# EAGLE design APDS-9801 (EAGLE 6.4)
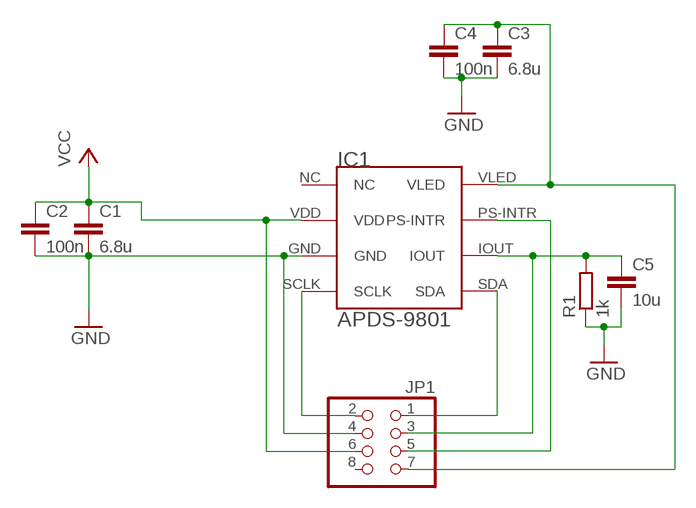
[diagram p0: schematic, sheet 1]

## Parts
C1  6.8u  C-EUC0805  [C0805]
C2  100n  C-EUC0805  [C0805]
C3  6.8u  C-EUC0805  [C0805]
C4  100n  C-EUC0805  [C0805]
C5  10u  C-EUC0805  [C0805]
IC1  APDS-9801  [APDS-9801]
JP1  PINHD-2X4  [2X04]
R1  1k  R-EU_M0805  [M0805]

## Nets
GND: C1.2 C2.2 C3.2 C4.2 C5.2 IC1.GND JP1.4 R1.1
N$1: IC1.PS-INTR JP1.5
N$3: C5.1 IC1.IOUT JP1.3 R1.2
N$5: C3.1 C4.1 IC1.VLED JP1.7
N$7: IC1.SCLK JP1.2
N$9: IC1.SDA JP1.1
VCC: C1.1 C2.1 IC1.VDD JP1.6
Unconnected: IC1.NC JP1.8

## Library data of the parts
C1-C5 = rcl:C-EU: CAPACITOR, European symbol
IC1 = BEEP:APDS-9801
JP1 = pinhead:PINHD-2X4: PIN HEADER
R1 = rcl:R-EU_: RESISTOR, European symbol

## Board
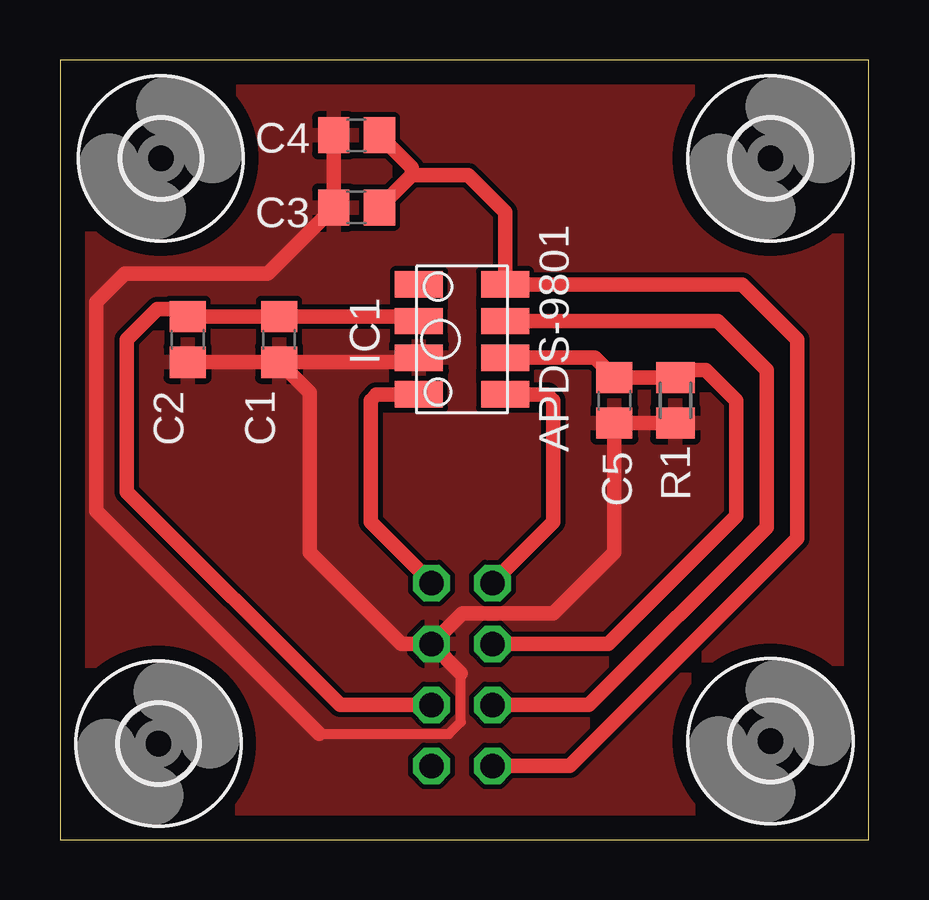
[diagram p1: board, top side]
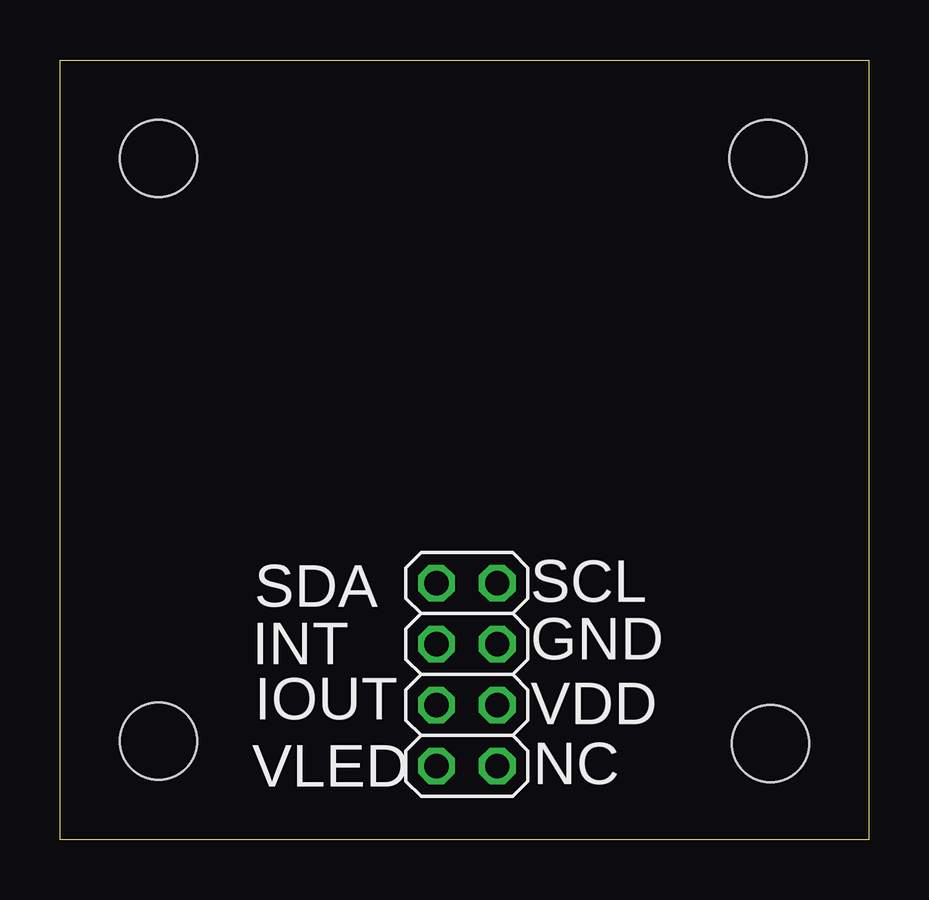
[diagram p2: board, bottom side, seen from below]

Size 33.7 x 32.5 mm. Coordinates in mm from the lower left corner, seen from the top.
Outline: 0,0 33.7,0 33.7,32.5 0,32.5 0,0
Copper layers (1*16): Top 0.035mm / dielectric 1.5mm / Bottom 0.035mm
Design rules "default": minimum track width 10mil, minimum drill 24mil, track to track 8mil, track to pad 8mil, pad to pad 8mil, via to via 8mil, smd to smd 8mil, copper to edge 40mil, drill to drill 8mil, minimum pad ring 10mil, minimum via ring 8mil, stop-mask expansion 4mil, vias tented up to drill 0mil, thermal gap 10mil

### Footprints (pad centres in the part's own frame; a part is rotated, then mirrored left to right if it is on the bottom)
C0805 = smd 1.3 x 1.5: 1 -0.95,0; 2 0.95,0
APDS-9801 = smd 1.1 x 2: GND 0.765,-1.8; IOUT 0.765,1.8; NC -2.295,-1.8; PS-INTR -0.765,1.8; SCLK 2.295,-1.8; SDA 2.295,1.8; VDD -0.765,-1.8; VLED -2.295,1.8
2X04 = drill 1.016 octagon: 1 -3.81,-1.27; 2 -3.81,1.27; 3 -1.27,-1.27; 4 -1.27,1.27; 5 1.27,-1.27; 6 1.27,1.27; 7 3.81,-1.27; 8 3.81,1.27
M0805 = smd 1.3 x 1.6: 1 -0.95,0; 2 0.95,0
3,2 = hole 3.2: 0,0

### Placement (x,y rotation side)
C1  9.13,20.85 270 top
C2  5.32,20.85 270 top
C3  12.36,26.35 180 top
C4  12.36,29.36 180 top
C5  23.1,18.31 270 top
IC1  16.75,20.85 270 top
JP1  16.75,6.88 270 bottom
R1  25.64,18.31 90 top
U$2  [3,2]  4.1,4 0 top
U$3  [3,2]  29.6,28.4 0 top
U$4  [3,2]  4.2,28.4 0 top
U$5  [3,2]  29.6,4.1 0 top

### Tracks (layer width: path | path; a pad name or v marks a point on that pad's centre or on a via)
GND
  Top 0.406: 10.8,4.4 16.2,4.4 16.7,4.9 16.7,6.93
  Top 0.61: C2.2 C1.2 | C1.2 14.77,19.9 IC1.GND | C1.2 10.4,18.63 10.4,11.96 14.21,8.15 JP1.4 | R1.1 C5.2 23.1,11.96 20.56,9.42 16.75,9.42 JP1.4 | C4.2 C3.2 8.66,23.6 2.7,23.6 1.5,22.4 1.5,13.7 10.8,4.4 | JP1.4 16.7,6.93
  pour Top: 0,32.5 33.7,32.5 33.7,0 0,0
N$1
  Top 0.61: IC1.PS-INTR 27.41,21.61 29.45,19.58 29.45,13.02 22.04,5.61 JP1.5
N$3
  Top 0.61: IC1.IOUT 22.27,20.09 C5.1 R1.2 25.96,19.58 26.91,19.58 28.18,18.31 28.18,13.49 22.84,8.15 JP1.3
N$5
  Top 0.61: 14.66,27.7 17,27.7 18.55,26.15 IC1.VLED 28.43,23.14 30.72,20.85 30.72,12.55 21.24,3.07 JP1.7 | 14.66,27.7 C3.1 | 14.66,27.7 14.66,28.01 C4.1
N$7
  Top 0.61: IC1.SCLK 13.19,18.55 12.94,18.31 12.94,13.23 JP1.2
N$9
  Top 0.61: IC1.SDA 20.32,18.55 20.56,18.31 20.56,13.23 JP1.1
VCC
  Top 0.61: IC1.VDD 14.77,21.8 C1.1 C2.1 5,22.12 4.05,22.12 2.78,20.85 2.78,14.5 11.67,5.61 JP1.6

### Text on the board
bNames: SCL | SDA | GND | INT | VDD | IOUT | NC | VLED